# Altium schematic sheet SDCARD.SchDoc
size 420 x 297 mm; SheetNumber: 10; SheetTotal: 23
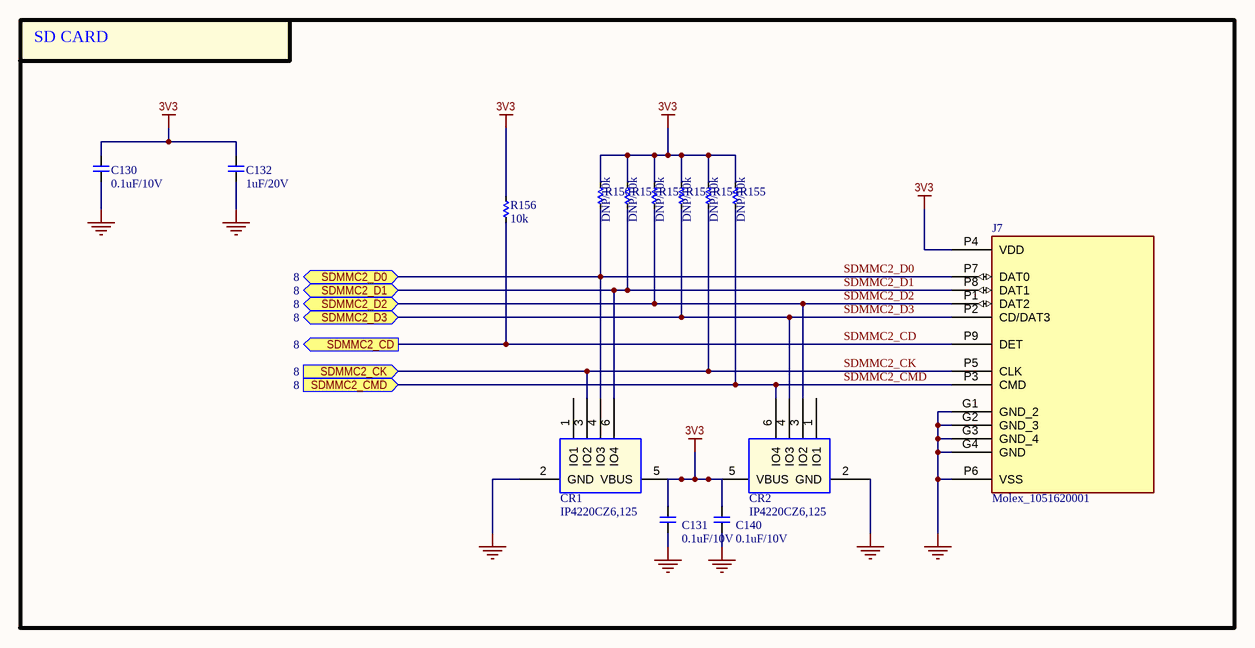
[diagram p0: SDCARD.SchDoc]

## Parts
C130  0.1uF/10V  [CAP_C_1005X50_L]
C131  0.1uF/10V  [CAP_C_1005X50_L]
C132  1uF/20V  [CAP_C_1005X50_L]
C140  0.1uF/10V  [CAP_C_1005X50_L]
CR1  IP4220CZ6,125  [DIODE_SOT457_1P7X3P1_NEX]
CR2  IP4220CZ6,125  [DIODE_SOT457_1P7X3P1_NEX]
J7  Molex_1051620001  [MOLEX_1051620001]
R150  DNP/10k  [RES_C_1005x30_L]
R151  DNP/10k  [RES_C_1005x30_L]
R152  DNP/10k  [RES_C_1005x30_L]
R153  DNP/10k  [RES_C_1005x30_L]
R154  DNP/10k  [RES_C_1005x30_L]
R155  DNP/10k  [RES_C_1005x30_L]
R156  10k  [RES_C_1005x30_L]

## Blocks framed on the sheet
SD CARD: C130-C132 C140 CR1 CR2 J7 R150-R156

## Ports
SDMMC2_CD (out, see 8), SDMMC2_CK (in, see 8), SDMMC2_CMD (in, see 8), SDMMC2_D0 (bidir, see 8), SDMMC2_D1 (bidir, see 8), SDMMC2_D2 (bidir, see 8), SDMMC2_D3 (bidir, see 8)

## Nets
3V3: C130.2 C131.2 C132.2 C140.2 CR1.5(VBUS) CR2.5(VBUS) J7.P4(VDD) R150.2 R151.2 R152.2 R153.2 R154.2 R155.2 R156.2
GND: C130.1 C131.1 C132.1 C140.1 CR1.2(GND) CR2.2(GND) J7.G1(GND_2) J7.G2(GND_3) J7.G3(GND_4) J7.G4(GND) J7.P6(VSS)
SDMMC2_CD: J7.P9(DET) R156.1 ; port SDMMC2_CD
SDMMC2_CK: CR1.3(IO2) J7.P5(CLK) R154.1 ; port SDMMC2_CK
SDMMC2_CMD: CR2.6(IO4) J7.P3(CMD) R155.1 ; port SDMMC2_CMD
SDMMC2_D0: CR1.4(IO3) J7.P7(DAT0) R150.1 ; port SDMMC2_D0
SDMMC2_D1: CR1.6(IO4) J7.P8(DAT1) R151.1 ; port SDMMC2_D1
SDMMC2_D2: CR2.3(IO2) J7.P1(DAT2) R152.1 ; port SDMMC2_D2
SDMMC2_D3: CR2.4(IO3) J7.P2(CD/DAT3) R153.1 ; port SDMMC2_D3

Not connected (* = marked no-connect by the designer): CR1 1(IO1); CR2 1(IO1)

## Notes on the sheet
- Project:
- BEE-1012
- Sub-system:
- SATELLITE_EXP_CONTROLLER
- Design by:
- SANG HUYNH
- BAO BUI
- Sheet title:
- Sheet
- A3
- of
- Checked by:
- Approved by:
- VU PHAM
- Revision:
- Document No:
- Size:
- Date:

## Library data of the parts
C130-C132 C140 = _CAP_C_2: CAP CHIP
CR1 CR2 = IP4220CZ6,125: TVS DIODE 5.5VWM 6TSOP; Manufacturer_Name: Nexperia; Copyright: Copyright (C) 2025 Ultra Librarian. All rights reserved.; Manufacturer_Part_Number: IP4220CZ6,125; RefDes: RefDes; Type: Type
J7 = Molex_1051620001: 9 (8 + 1) Position Card Connector Secure Digital - microSDâ„¢ Surface Mount, Right Angle Gold; MF: Molex; SnapEDA_Link: https://www.snapeda.com/parts/1051620001/Molex/view-part/?ref=snap; Package: None; Value: *; MP: 1051620001; Check_prices: https://www.snapeda.com/parts/1051620001/Molex/view-part/?ref=eda
R150-R156 = _RES_B_2: RES